# EAGLE design ATO_V2_SCHEMATIC (EAGLE 9.3.0)
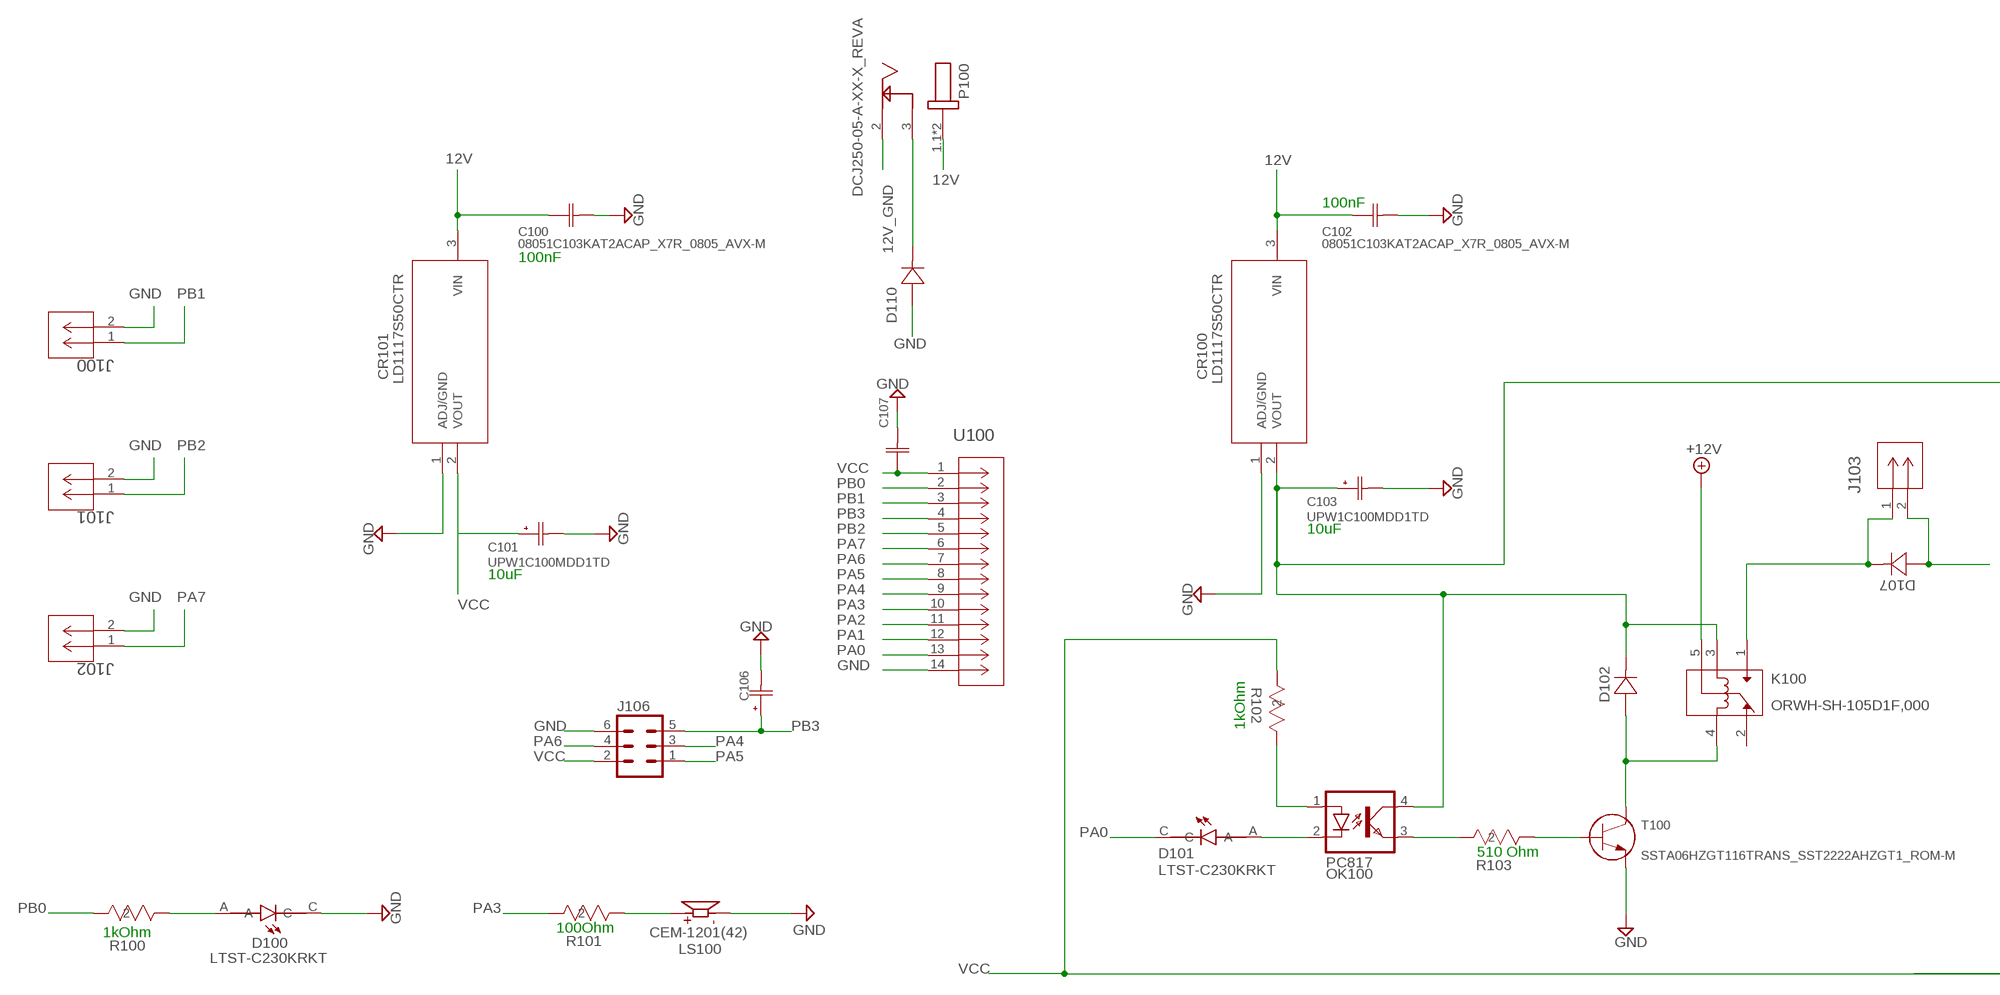
[diagram p0: schematic, sheet 1, part 1 of 2]
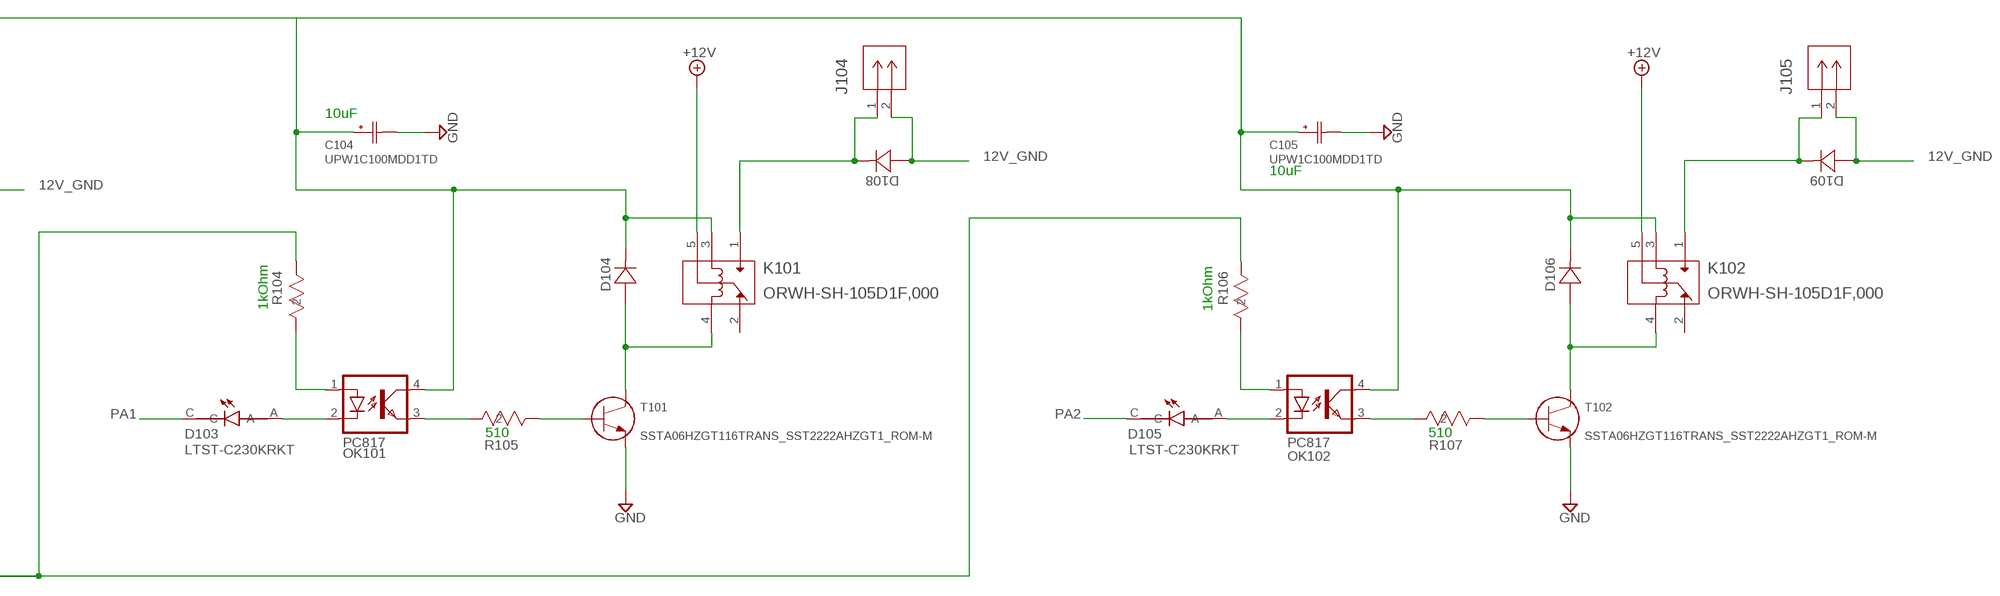
[diagram p1: schematic, sheet 1, part 2 of 2]

## Parts
C100  08051C103KAT2ACAP_X7R_0805_AVX-M  [CAP_X7R_0805_AVX-M]
C101  UPW1C100MDD1TD  [CAP_UEP_5X11_NCH]
C102  08051C103KAT2ACAP_X7R_0805_AVX-M  [CAP_X7R_0805_AVX-M]
C103  UPW1C100MDD1TD  [CAP_UEP_5X11_NCH]
C104  UPW1C100MDD1TD  [CAP_UEP_5X11_NCH]
C105  UPW1C100MDD1TD  [CAP_UEP_5X11_NCH]
C106  UPW1C100MDD1TD  [CAP_UEP_5X11_NCH]
C107  08051C103KAT2ACAP_X7R_0805_AVX-M  [CAP_X7R_0805_AVX-M]
CR100  LD1117S50CTR  [SOT-223_STM]
CR101  LD1117S50CTR  [SOT-223_STM]
D100  LTST-C230KRKT  [LEDC3216X110]
D101  LTST-C230KRKT  [LEDC3216X110]
D102  1SMB5922B-13  [SMB_DIO]
D103  LTST-C230KRKT  [LEDC3216X110]
D104  1SMB5922B-13  [SMB_DIO]
D105  LTST-C230KRKT  [LEDC3216X110]
D106  1SMB5922B-13  [SMB_DIO]
D107  1SMB5922B-13  [SMB_DIO]
D108  1SMB5922B-13  [SMB_DIO]
D109  1SMB5922B-13  [SMB_DIO]
D110  1SMB5922B-13  [SMB_DIO]
J100  B2B-XH-A(LF)(SN)  [CONN_B2B-XH-A(LF)(SN)_JST]
J101  B2B-XH-A(LF)(SN)  [CONN_B2B-XH-A(LF)(SN)_JST]
J102  B2B-XH-A(LF)(SN)  [CONN_B2B-XH-A(LF)(SN)_JST]
J103  B2B-XH-A(LF)(SN)  [CONN_B2B-XH-A(LF)(SN)_JST]
J104  B2B-XH-A(LF)(SN)  [CONN_B2B-XH-A(LF)(SN)_JST]
J105  B2B-XH-A(LF)(SN)  [CONN_B2B-XH-A(LF)(SN)_JST]
J106  MA03-2  [MA03-2]
K100  ORWH-SH-105D1F,000  [RELAY_1-1721150-0_TEC]
K101  ORWH-SH-105D1F,000  [RELAY_1-1721150-0_TEC]
K102  ORWH-SH-105D1F,000  [RELAY_1-1721150-0_TEC]
LS100  CEM-1201(42)  [CUI_CEM-1201(42)]
OK100  PC817  [DIL04]
OK101  PC817  [DIL04]
OK102  PC817  [DIL04]
P100  DCJ250-05-A-XX-X_REVA  [GCT_DCJ250-05-A-XX-X_REVA]
R100  CRCW0805510RJNEA  [RC0805N_VIS]
R101  CRCW0805510RJNEA  [RC0805N_VIS]
R102  CRCW0805510RJNEA  [RC0805N_VIS]
R103  CRCW0805510RJNEA  [RC0805N_VIS]
R104  CRCW0805510RJNEA  [RC0805N_VIS]
R105  CRCW0805510RJNEA  [RC0805N_VIS]
R106  CRCW0805510RJNEA  [RC0805N_VIS]
R107  CRCW0805510RJNEA  [RC0805N_VIS]
T100  SSTA06HZGT116TRANS_SST2222AHZGT1_ROM-M  [TRANS_SST2222AHZGT1_ROM-M]
T101  SSTA06HZGT116TRANS_SST2222AHZGT1_ROM-M  [TRANS_SST2222AHZGT1_ROM-M]
T102  SSTA06HZGT116TRANS_SST2222AHZGT1_ROM-M  [TRANS_SST2222AHZGT1_ROM-M]
U100  1-2199298-3  [CONN14_1-2199298-3_TEC]

## Nets
12V: C100.1 C102.1 CR100.3(VIN) CR101.3(VIN) K100.5 K101.5 K102.5 P100.1.1 P100.1.2 ; supply symbol labelled +12V
12V_GND: D107.2 D108.2 D109.2 D110.1 J103.2 J104.2 J105.2 P100.2 P100.3
GND: C100.2 C101.2 C102.2 C103.2 C104.2 C105.2 C106.2 C107.2 CR100.1(ADJ/GND) CR101.1(ADJ/GND) D100.C D110.2 J100.2 J101.2 J102.2 J106.6 LS100.M T100.2 T101.2 T102.2 U100.14
N$1: OK100.3(EMIT) R103.2
N$2: D101.A OK100.2(C)
N$4: D104.2 K101.4 T101.3
N$5: D102.2 K100.4 T100.3
N$6: OK100.1(A) R102.1
N$7: R103.1 T100.1
N$8: D100.A R100.1
N$9: C103.1 C104.1 C105.1 CR100.2(VOUT) D102.1 D104.1 D106.1 K100.3 K101.3 K102.3 OK100.4(COL) OK101.4(COL) OK102.4(COL)
N$10: D107.1 J103.1 K100.1
N$12: D103.A OK101.2(C)
N$13: OK101.1(A) R104.2
N$14: OK101.3(EMIT) R105.2
N$15: R105.1 T101.1
N$17: D108.1 J104.1 K101.1
N$18: D106.2 K102.4 T102.3
N$19: D105.A OK102.2(C)
N$20: OK102.1(A) R106.2
N$21: OK102.3(EMIT) R107.2
N$22: R107.1 T102.1
N$23: D109.1 J105.1 K102.1
N$26: LS100.P R101.1
PA0: D101.C U100.13
PA1: D103.C U100.12
PA2: D105.C U100.11
PA3: R101.2 U100.10
PA4: J106.3 U100.9
PA5: J106.1 U100.8
PA6: J106.4 U100.7
PA7: J102.1 U100.6
PB0: R100.2 U100.2
PB1: J100.1 U100.3
PB2: J101.1 U100.5
PB3: C106.1 J106.5 U100.4
VCC: C101.1 C107.1 CR101.2(VOUT) J106.2 R102.2 R104.1 R106.1 U100.1
Unconnected: K100.2 K101.2 K102.2

## Notes on the sheet
- 100nF
- 100nF
- 10uF
- 10uF
- 10uF
- 10uF
- 1kOhm | 1kOhm
- 1kOhm
- 510 | 510
- 510 Ohm
- 100Ohm
- 1kOhm

## Library data of the parts
C100 C102 C107 = CAP CER 0805:08051C103KAT2A; COPYRIGHT: Copyright (C) 2021 Ultra Librarian. All rights reserved.; MANUFACTURER_PART_NUMBER: 08051C103KAT2A; MFR_NAME: AVX Corporation
C101 C103-C106 = CAP ALUM 10UF 20% 16V RADIAL:UPW1C100MDD1TD; COPYRIGHT: Copyright (C) 2021 Ultra Librarian. All rights reserved.; DIGI-KEY_PART_NUMBER_1: 493-11374-1-ND; DIGI-KEY_PART_NUMBER_2: 493-11374-3-ND; MANUFACTURER_PART_NUMBER: UPW1C100MDD1TD; MFR_NAME: Nichicon
CR100 CR101 = IC REG LINEAR 5V 800MA SOT223:LD1117S50CTR; COPYRIGHT: Copyright (C) 2021 Ultra Librarian. All rights reserved.; DIGI-KEY_PART_NUMBER_1: 497-1243-1-ND; DIGI-KEY_PART_NUMBER_2: 497-1243-2-ND; DIGI-KEY_PART_NUMBER_3: 497-1243-6-ND; MANUFACTURER_PART_NUMBER: LD1117S50CTR; MFR_NAME: STMicroelectronics
D100 D101 D103 D105 = LTST-C230KRKT:LTST-C230KRKT: LED SMT RED CLR 1206 TAPE; DESCRIPTION: Red 631nm LED Indication - Discrete 2V 1206 _3216 Metric_; DIGI-KEY_PART_NUMBER: 160-1457-1-ND; DIGI-KEY_PURCHASE_URL: https://www.digikey.com/product-detail/en/lite-on-inc/LTST-C230KRKT/160-1457-1-ND/386856?utm_source=snapeda&utm_medium=aggregator&utm_campaign=symbol; MF: Lite-On Inc.; MP: LTST-C230KRKT; PACKAGE: 1206 Lite-On
D102 D104 D106-D110 = Zener Diode 5.1 V 5 W ±5% Surface Mount SMB (DO-214AA):1SMB5922B-13; COPYRIGHT: Copyright (C) 2021 Ultra Librarian. All rights reserved.; MANUFACTURER_PART_NUMBER: 1SMB5922B-13; MFR_NAME: Diodes Inc
J100-J105 = JST XH CONN HEADER VERT 2POS 2.5MM:B2B-XH-A(LF)(SN); COPYRIGHT: Copyright (C) 2021 Ultra Librarian. All rights reserved.; DIGI-KEY_PART_NUMBER_1: 455-2247-ND; MANUFACTURER_PART_NUMBER: B2B-XH-A(LF)(SN); MFR_NAME: JST
J106 = con-lstb:MA03-2: PIN HEADER; OC_FARNELL: unknown; OC_NEWARK: unknown
K100-K102 = RELAY GEN PURPOSE SPDT 10A 5V:ORWH-SH-105D1F,000; COPYRIGHT: Copyright (C) 2021 Ultra Librarian. All rights reserved.; DIGI-KEY_PART_NUMBER_1: PB2032-ND; MANUFACTURER_PART_NUMBER: ORWH-SH-105D1F,000; MFR_NAME: TE Connectivity
LS100 = CEM-1201_42_:CEM-1201(42): Audio Buzzer Magnetic 1Vo-p 2Vo-p 20mA 1.5Vo-p 85dBA Pin Through Hole Tray; AVAILABILITY: Unavailable; CUI_PURCHASE_URL: https://www.cuidevices.com/product/audio/buzzers/audio-transducers/cem-1201_42_?utm_source=snapeda.com&utm_medium=referral&utm_campaign=snapedaBOM; DESCRIPTION: 12 mm, 1.5 V, 85 dB, Through Hole, Magnetic Audio Transducer Buzzer; MF: CUI Devices; MP: CEM-1201_42_; PACKAGE: CUI Inc.; PRICE: None
OK100-OK102 = optocoupler:PC817: SHARP OPTO COUPLER; MPN: PC817X4J000F; OC_FARNELL: 9707727; OC_NEWARK: 97K7059
P100 = DCJ250-05-A-XX-X_REVA:DCJ250-05-A-XX-X_REVA: DC Power Jack, SMT, Horizontal, with Locating Pegs, D2.5mm; DESCRIPTION: Power Barrel Connector Jack 2.55mm ID (0.100), 5.50mm OD (0.217) Surface Mount, Right Angle; DIGI-KEY_PART_NUMBER: 2073-DCJ250-05-A-K1-ACT-ND; MF: Global Connector Technology; MP: DCJ250-05-A-K1-A; PACKAGE: None; PURCHASE-URL: https://pricing.snapeda.com/search/part/DCJ250-05-A-K1-A/?ref=eda
R100-R107 = RES SMD 2010:CRCW0805510RJNEA; COPYRIGHT: Copyright (C) 2021 Ultra Librarian. All rights reserved.; DIGI-KEY_PART_NUMBER_1: 541-510ACT-ND; DIGI-KEY_PART_NUMBER_2: 541-510ADKR-ND; DIGI-KEY_PART_NUMBER_3: 541-510ATR-ND; MANUFACTURER_PART_NUMBER: CRCW0805510RJNEA; MFR_NAME: Vishay
T100-T102 = NPN GENERAL PURPOSE TRANSISTOR:SSTA06HZGT116; COPYRIGHT: Copyright (C) 2021 Ultra Librarian. All rights reserved.; DIGI-KEY_PART_NUMBER_1: SSTA06HZGT116CT-ND; DIGI-KEY_PART_NUMBER_2: SSTA06HZGT116DKR-ND; DIGI-KEY_PART_NUMBER_3: SSTA06HZGT116TR-ND; MANUFACTURER_PART_NUMBER: SSTA06HZGT116; MFR_NAME: ROHM Semiconductor
U100 = CONN IC DIP SOCKET 14POS TIN:1-2199298-3; COPYRIGHT: Copyright (C) 2021 Ultra Librarian. All rights reserved.; DIGI-KEY_PART_NUMBER_1: A120348-ND; MANUFACTURER_PART_NUMBER: 1-2199298-3; MFR_NAME: TE Connectivity; TYPE: DIP

## Board
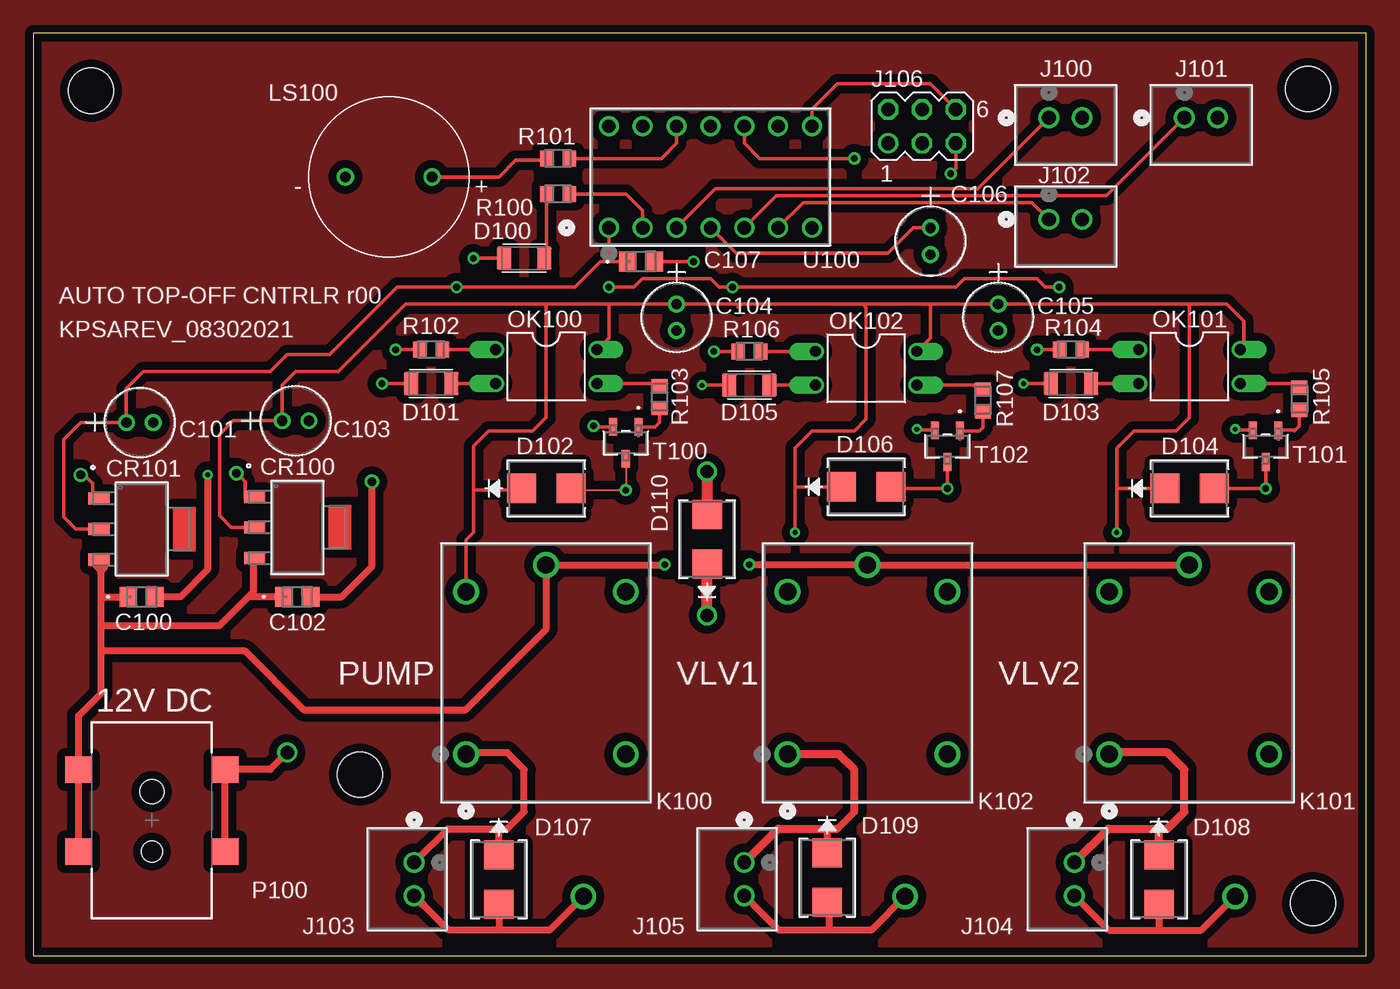
[diagram p2: board, top side]
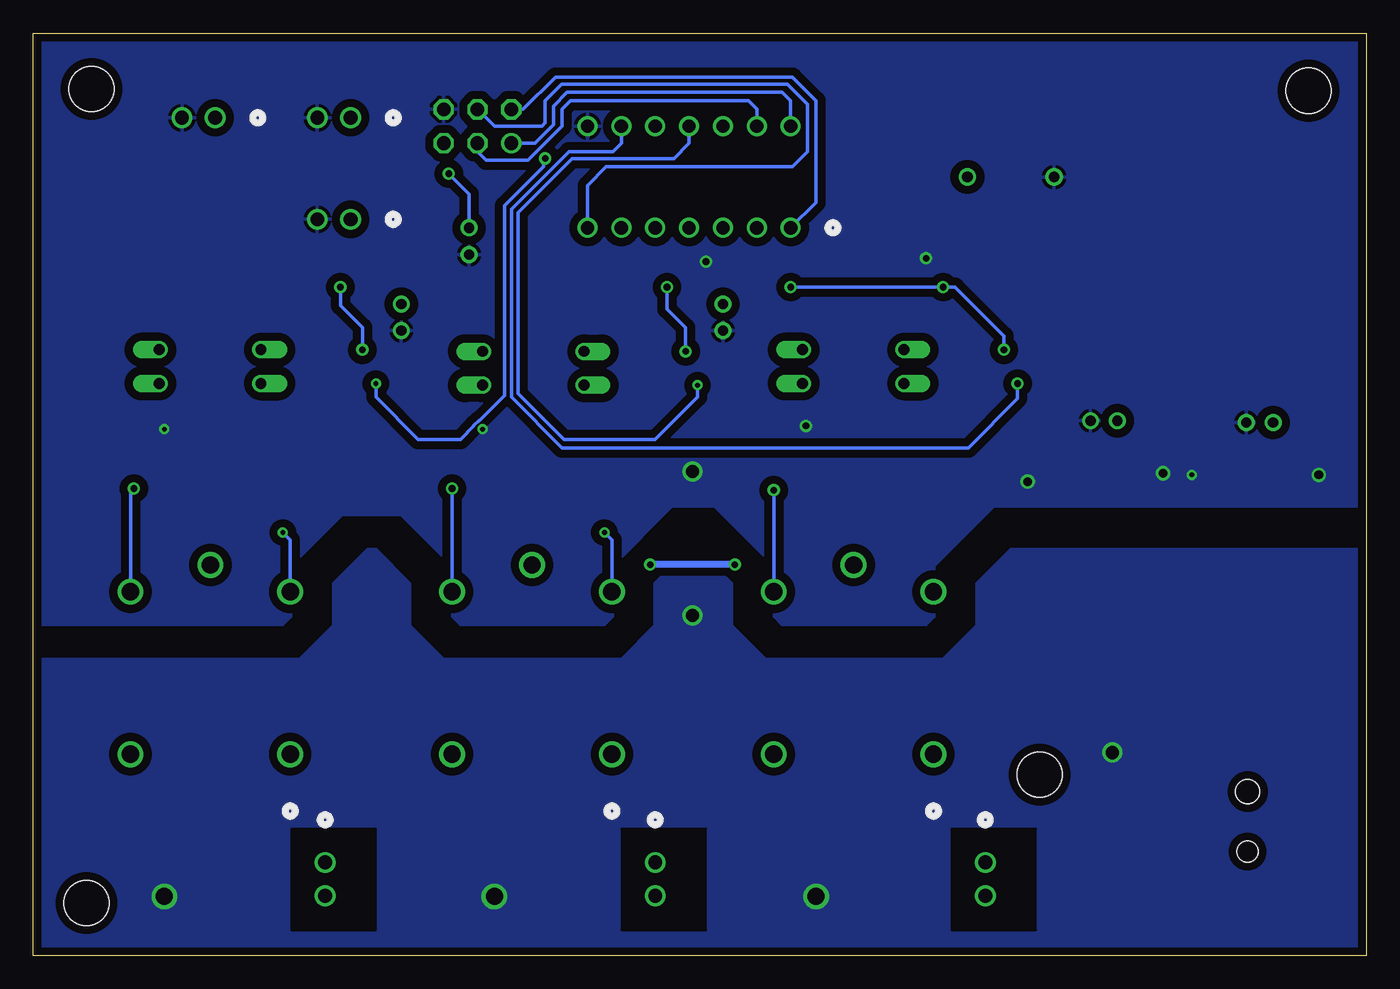
[diagram p3: board, bottom side, seen from below]

Size 100 x 69.2 mm. Coordinates in mm from the lower left corner, seen from the top.
Outline: 0,0 100,0 100,69.2 0,69.2 0,0
Copper layers (1*16): Top 0.035mm / dielectric 1.5mm / Bottom 0.035mm
Design rules "default *": minimum track width 6mil, minimum drill 0.35mm, track to track 6mil, track to pad 6mil, pad to pad 6mil, via to via 6mil, smd to smd 6mil, copper to edge 16mil, drill to drill 6mil, minimum pad ring 10mil, minimum via ring 8mil, stop-mask expansion 4mil, vias tented up to drill 0mil, thermal gap 10mil
Holes 3.4 mm at 95.63,65.02 4.32,64.9 24.51,13.59 96.01,3.94

### Footprints (pad centres in the part's own frame; a part is rotated, then mirrored left to right if it is on the bottom)
CAP_X7R_0805_AVX-M = smd 1.321 x 1.499: 1 -1.003,0; 2 1.003,0
CAP_UEP_5X11_NCH = drill 0.762 pad 1.27: 1 0,0; 2 2.007,0
SOT-223_STM = smd 0.914 x 1.6: 1 -2.3,-3.2; 2 0,-3.2; 3 2.3,-3.2
LEDC3216X110 = smd 1.1 x 1.73: A 1.51,0; C -1.51,0
SMB_DIO = smd 2.18 x 2.21: 1 -1.857,0; 2 1.857,0
CONN_B2B-XH-A(LF)(SN)_JST = drill 1.041 pad 1.549: 1 0,0; 2 -2.489,0
MA03-2 = drill 1.016: 1 -2.54,-1.27 | drill 1.016 octagon: 2 -2.54,1.27; 3 0,-1.27; 4 0,1.27; 5 2.54,-1.27; 6 2.54,1.27
RELAY_1-1721150-0_TEC = drill 1.295 pad 1.803: 1 -12.192,11.989; 2 -12.192,0; 3 0,11.989; 4 0,0; 5 2.007,5.994
CUI_CEM-1201(42) = drill 0.8: M 3.25,0; P -3.25,0
DIL04 = drill 0.813 offset: 1 -1.27,-3.81; 2 1.27,-3.81; 3 1.27,3.81; 4 -1.27,3.81
GCT_DCJ250-05-A-XX-X_REVA = smd 2 x 2: 1.1 -5.5,3.8; 1.2 -5.5,-2.35; 2 5.5,-2.35; 3 5.5,3.8 | hole 1.8: 0,2.15 | hole 1.6: 0,-2.35
RC0805N_VIS = smd 1.006 x 1.2: 1 -0.853,0; 2 0.853,0
TRANS_SST2222AHZGT1_ROM-M = smd 0.61 x 1.321: 1 -0.95,-1.194; 2 0.95,-1.194; 3 0,1.194
CONN14_1-2199298-3_TEC = drill 0.991 pad 1.499: 1 0,0; 2 2.54,0; 3 5.08,0; 4 7.62,0; 5 10.16,0; 6 12.7,0; 7 15.24,0; 8 0,7.62; 9 2.54,7.62; 10 5.08,7.62; 11 7.62,7.62; 12 10.16,7.62; 13 12.7,7.62; 14 15.24,7.62

### Placement (x,y rotation side)
C100  8.13,26.92 0 top
C101  6.99,40.01 0 top
C102  19.81,26.92 0 top
C103  18.67,40.13 0 top
C104  48.26,48.9 270 top
C105  72.39,48.9 270 top
C106  67.31,54.61 270 top
C107  45.59,52.07 0 top
CR100  19.81,32.13 270 top
CR101  8.13,32 270 top
D100  36.83,52.32 0 top
D101  29.84,42.93 0 top
D102  38.48,35.05 0 top
D103  77.85,42.93 0 top
D104  86.74,35.05 0 top
D105  53.72,42.8 0 top
D106  62.48,35.18 0 top
D107  34.92,5.71 270 top
D108  84.45,5.71 270 top
D109  59.56,5.84 270 top
D110  50.55,31.24 90 top
J100  76.2,62.87 180 top
J101  86.36,62.87 180 top
J102  76.2,55.24 180 top
J103  28.57,6.99 90 top
J104  78.11,6.99 90 top
J105  53.34,6.99 90 top
J106  66.67,62.23 0 top
K100  44.45,27.3 90 top
K101  92.71,27.3 90 top
K102  68.58,27.3 90 top
LS100  26.67,58.42 180 top
OK100  38.48,44.2 270 top
OK101  86.74,44.2 270 top
OK102  62.48,44.07 270 top
P100  8.89,10.16 0 top
R100  39.37,57.15 0 top
R101  39.37,59.82 0 top
R102  29.84,45.47 180 top
R103  46.99,41.91 90 top
R104  77.85,45.47 0 top
R105  95,41.78 90 top
R106  53.72,45.34 0 top
R107  71.25,41.66 90 top
T100  44.45,38.48 180 top
T101  92.46,38.23 180 top
T102  68.58,38.23 180 top
U100  43.18,54.61 0 top

### Tracks (layer width: path | path; a pad name or v marks a point on that pad's centre or on a via)
12V  (via drill 0.5)
  Top 0.254: CR100.3 16.51,29.73
  Top 0.508: 5.08,22.86 15.88,22.86 20.32,18.41 32.38,18.41 38.46,24.49 K100.5 47.35,29.31 v47.37,29.34 | P100.1.2 P100.1.1 3.39,18 5.08,19.68 5.08,22.86 | 5.08,22.86 5.08,24.77 | 5.08,24.77 13.97,24.77 16.13,26.92 | 5.08,24.77 5.08,26.67 | 5.08,26.67 5.08,29.21 | 4.93,29.36 CR101.3 | 16.13,26.92 16.51,27.3 16.51,29.73 | C102.1 16.13,26.92 | 5.08,26.67 5.33,26.92 C100.1 | 86.69,29.34 K101.5 K102.5 62.56,29.34 v53.72,29.34
  Top 1.016: 5.08,29.21 4.93,29.36
  Bottom 0.508: v47.37,29.34 v53.72,29.34
12V_GND  (via drill 1, 1 pad 1.2, 1.27)
  Top 0.254: 15.24,13.96 P100.3 14.39,13.34
  Top 0.508: 15.24,13.96 17.77,13.96 v19.05,15.24 | P100.2 14.39,13.34 14.39,13.76 | v41.27,4.45 38.73,1.91 34.92,1.91 | J103.2 31.17,1.91 34.92,1.91 | D107.2 34.92,1.91 | J105.2 55.93,1.91 59.69,1.91 | 59.69,1.91 62.87,1.91 v65.41,4.45 | 59.69,3.86 59.69,1.91 | J104.2 80.7,1.91 84.45,1.91 | 84.45,1.91 87.63,1.91 v90.17,4.45 | D108.2 84.45,1.91
  Top 0.61: J103.2 29.26,3.81 | D109.2 59.69,3.86
  Top 0.813: v50.55,25.53 D110.1
  Top 1.016: 14.61,13.97 14.39,13.76
  pour Bottom (isolate 0.61): -2.54,30.48 26.67,30.48 29.21,27.94 29.21,24.77 31.75,22.23 45.09,22.23 47.62,24.77 47.62,27.94 50.16,30.48 50.8,30.48 53.34,27.94 53.34,24.77 55.88,22.23 69.22,22.23 71.75,24.77 71.75,27.94 74.3,30.48 74.93,30.48 77.47,27.94 77.47,24.77 80.01,22.23 102.87,22.23 102.87,-1.91 -5.08,-1.91 -6.35,-3.17 -6.35,26.67
GND  (via drill 0.35, 0.5, 0.65 pad 0.8, 1)
  Top 0.254: v15.24,36.2 15.88,35.56 15.88,34.29 16.47,34.29 CR100.1 | v3.56,36.07 3.81,36.07 4.45,35.43 4.45,34.29 4.46,34.3 CR101.1 | T100.2 42.11,39.67 v42.04,39.75 | v66.29,39.5 66.37,39.42 T102.2 | v90.17,39.5 90.25,39.42 T101.2 | v33.02,52.32 D100.C | U100.14 58.42,63.5 60.33,65.41 67.31,65.41 J106.6 | 49.52,52.06 v49.53,52.07 C107.2
  Top 0.508: C102.2 23.11,26.92 25.4,29.21 v25.4,35.56 | C100.2 11.05,26.92 13.08,28.96 v13.08,36.07
  Top 0.813: v50.55,36.32 D110.2
  pour Bottom (isolate 0.61): -1.27,33.66 27.94,33.66 31.75,29.84 32.38,29.21 32.38,26.67 32.38,25.4 33.02,24.77 43.18,24.77 43.81,24.77 44.45,25.4 44.45,29.21 48.9,33.66 52.07,33.66 56.52,29.21 56.52,25.4 57.15,24.77 63.5,24.77 67.94,24.77 68.58,25.4 68.58,29.21 72.39,33.02 76.2,33.02 76.83,33.02 80.64,29.21 80.64,26.04 80.64,25.4 81.28,24.77 83.19,24.77 101.6,24.77 102.23,25.4 102.23,83.19 100.33,85.09 -2.54,85.09 -3.81,83.82 -3.81,35.56 -1.91,33.66
N$1
  Top 0.254: OK100.3 46.83,42.93 R103.2
N$2
  Top 0.254: OK100.2 D101.A
N$4  (via drill 0.5)
  Top 0.254: D104.2 v92.46,35.05 T101.3
  Bottom 0.254: v92.46,35.05 92.71,34.8 K101.4
N$5  (via drill 0.5)
  Top 0.152: D102.2 arc90 40.47,34.92 v44.45,34.92 T100.3
  Bottom 0.254: K100.4 v44.45,34.92
N$6
  Top 0.254: R102.1 OK100.1
N$7
  Top 0.254: T100.1 46.66,39.67 46.99,40.01 R103.1
N$8
  Top 0.254: D100.A 38.52,52.5 R100.1
N$9  (via drill 0.35)
  Top 0.254: CR100.2 14.86,32.13 13.97,33.02 13.97,39.12 14.99,40.13 C103.1 18.67,42.8 19.68,43.81 22.86,43.81 27.94,48.9 38.48,48.9 | K100.3 32.46,31.19 33.02,31.75 33.02,34.92 | 33.02,34.92 33.02,38.23 34.16,39.37 37.47,39.37 38.48,40.39 38.48,48.9 | 36.5,34.92 33.02,34.92 | OK101.4 90.81,45.47 90.81,47.62 89.53,48.9 86.74,48.9 | 38.48,48.9 43.18,48.9 | 43.18,48.9 C104.1 53.09,48.9 | 53.09,48.9 62.23,48.9 | 62.23,48.9 67.31,48.9 | OK100.4 43.18,46.35 43.18,48.9 | v57.15,31.75 57.15,35.18 | 57.15,35.18 57.15,38.1 58.42,39.37 61.59,39.37 62.48,40.26 62.48,48.64 62.23,48.9 | D106.1 57.15,35.18 | OK102.4 67.31,46.35 67.31,48.9 | 52.87,48.68 53.09,48.9 | v81.28,31.75 81.28,35.05 | 81.28,35.05 81.28,38.1 82.55,39.37 85.72,39.37 86.74,40.39 86.74,48.9 | D104.1 81.28,35.05 | 86.74,48.9 C105.1 67.31,48.9
  Top 0.813: D102.1 36.5,34.92
  Bottom 0.254: K102.3 56.59,31.19 v57.15,31.75 | K101.3 80.72,31.19 v81.28,31.75
N$10
  Top 0.254: K100.1 32.89,15.11 33.02,15.24
  Top 0.508: J103.1 31.11,9.53 34.92,9.53 | 34.92,9.53 35.56,9.53 36.83,10.79 36.83,13.97 35.56,15.24 33.02,15.24 | D107.1 34.92,9.53
N$12
  Top 0.254: D103.A OK101.2
N$13
  Top 0.254: R104.2 OK101.1
N$14
  Top 0.254: OK101.3 94.71,42.93 R105.2
N$15
  Top 0.254: R105.1 95,39.75 94.61,39.37 94.56,39.42 T101.1
N$17
  Top 0.61: J104.1 80.64,9.53 84.45,9.53 | 84.45,9.53 85.09,9.53 86.36,10.79 86.36,13.97 85.09,15.24 80.85,15.24 K101.1 | D108.1 84.45,9.53
N$18  (via drill 0.5)
  Top 0.254: D106.2 64.47,35.05 v68.58,35.05 T102.3
  Bottom 0.254: v68.58,35.05 K102.4
N$19
  Top 0.254: D105.A OK102.2
N$20
  Top 0.254: R106.2 OK102.1
N$21
  Top 0.254: OK102.3 70.96,42.8 R107.2
N$22
  Top 0.254: R107.1 71.25,39.62 70.99,39.37 69.58,39.37 T102.1
N$23
  Top 0.508: 60.33,9.53 61.59,10.79 | D109.1 59.56,9.4
  Top 0.61: J105.1 55.88,9.53 59.69,9.53 | 59.69,9.53 60.33,9.53 | 61.59,10.79 61.59,13.97 60.45,15.11 K102.1 | 59.56,9.4 59.69,9.53
N$26
  Top 0.254: R101.1 38.39,59.69 36.2,59.69 34.92,58.42 LS100.P
PA0  (via drill 0.5)
  Top 0.254: v26.16,42.93 D101.C
  Bottom 0.254: v26.16,42.93 26.16,41.78 29.84,38.1 60.33,38.1 64.14,41.91 64.14,56.01 59.82,60.33 56.52,60.33 55.88,60.96 U100.13
PA1  (via drill 0.35, 0.5)
  Top 0.254: v74.3,42.93 D103.C | U100.12 53.34,60.96 54.48,59.82 v61.59,59.82 61.72,59.82
  Bottom 0.254: v61.59,59.82 61.72,59.69 61.72,59.18 64.64,56.26 64.64,42.04 66.53,40.16 66.57,40.16 66.95,39.77 66.95,39.73 67.94,38.73 71.12,38.73 74.3,41.91 v74.3,42.93
PA2  (via drill 0.35)
  Top 0.254: v50.16,42.8 D105.C
  Bottom 0.254: v50.16,42.8 50.16,41.91 53.34,38.73 60.2,38.73 63.63,42.16 63.63,55.75 59.56,59.82 51.94,59.82 50.8,60.96 U100.11
PA3
  Top 0.254: R101.2 47.12,59.82 48.26,60.96 U100.10
PA4
  Bottom 0.254: U100.9 45.72,63.5 46.35,64.14 59.69,64.14 60.33,63.5 60.33,62.23 62.87,59.69 66.04,59.69 66.67,60.33 J106.3
PA5
  Bottom 0.254: U100.8 43.18,64.14 43.81,64.77 59.94,64.77 60.96,63.75 60.96,62.36 62.36,60.96 J106.1
PA6
  Bottom 0.254: J106.4 65.41,62.23 61.85,62.23 61.59,62.48 61.59,64.14 60.35,65.38 43.41,65.38 41.91,63.88 41.91,60.33 43.05,59.18 57.02,59.18 58.42,57.78 U100.7
PA7
  Top 0.254: U100.6 57.78,56.52 74.93,56.52 J102.1
PB0
  Top 0.254: U100.2 45.72,55.88 44.45,57.15 R100.2
PB1
  Top 0.254: U100.3 51.18,57.53 70.87,57.53 J100.1
PB2
  Top 0.254: U100.5 55.75,57.02 80.52,57.02 J101.1
PB3  (via drill 0.5)
  Top 0.254: v68.83,58.67 69.22,59.05 J106.5 | U100.4 52.7,52.7 64.14,52.7 66.04,54.61 C106.1
  Bottom 0.254: C106.1 67.31,57.15 v68.83,58.67
TOP
  pour Top (isolate 0.61): -5.71,73.66 -6.35,73.03 -6.35,-5.71 104.14,-5.71 104.14,74.3 -5.71,74.3
VCC  (via drill 0.5)
  Top 0.254: CR101.2 3.17,32 2.29,32.89 2.29,38.73 3.56,40.01 C101.1 6.99,42.55 8.26,43.81 17.78,43.81 19.05,45.09 22.23,45.09 27.3,50.16 v31.75,50.16 40.64,50.16 42.55,52.07 43.18,52.07 | 43.18,52.07 U100.1 | v75.31,45.47 R104.1 | v51.05,45.34 R106.1 | C107.1 43.18,52.07 | v43.18,50.16 45.09,50.16 45.72,50.8 50.8,50.8 51.44,50.16 v52.45,50.16 69.22,50.16 69.85,50.8 75.31,50.8 75.95,50.16 v76.96,50.16 | R102.2 v27.18,45.47
  Bottom 0.254: U100.1 41.27,56.52 41.27,64.14 43.05,65.91 60.83,65.91 63.25,63.5 J106.2 | v75.31,45.47 75.31,47.12 76.96,48.77 v76.96,50.16 | v27.18,45.47 27.18,46.48 30.86,50.16 v31.75,50.16 v43.18,50.16 | v51.05,45.34 51.05,47.12 52.45,48.51 v52.45,50.16
VOID
  cutout Bottom (no thermals): 24.77,9.53 31.11,9.53 31.11,1.91 24.77,1.91
  cutout Bottom (no thermals): 49.53,9.53 55.88,9.53 55.88,1.91 49.53,1.91
  cutout Bottom (no thermals): 74.3,9.53 80.64,9.53 80.64,1.91 74.3,1.91

### Text on the board
tPlace: AUTO TOP-OFF CNTRLR r00 | KPSAREV_08302021 | 12V DC
tNames: PUMP | VLV1 | VLV2